# Altium schematic sheet Pico.SchDoc
size A4
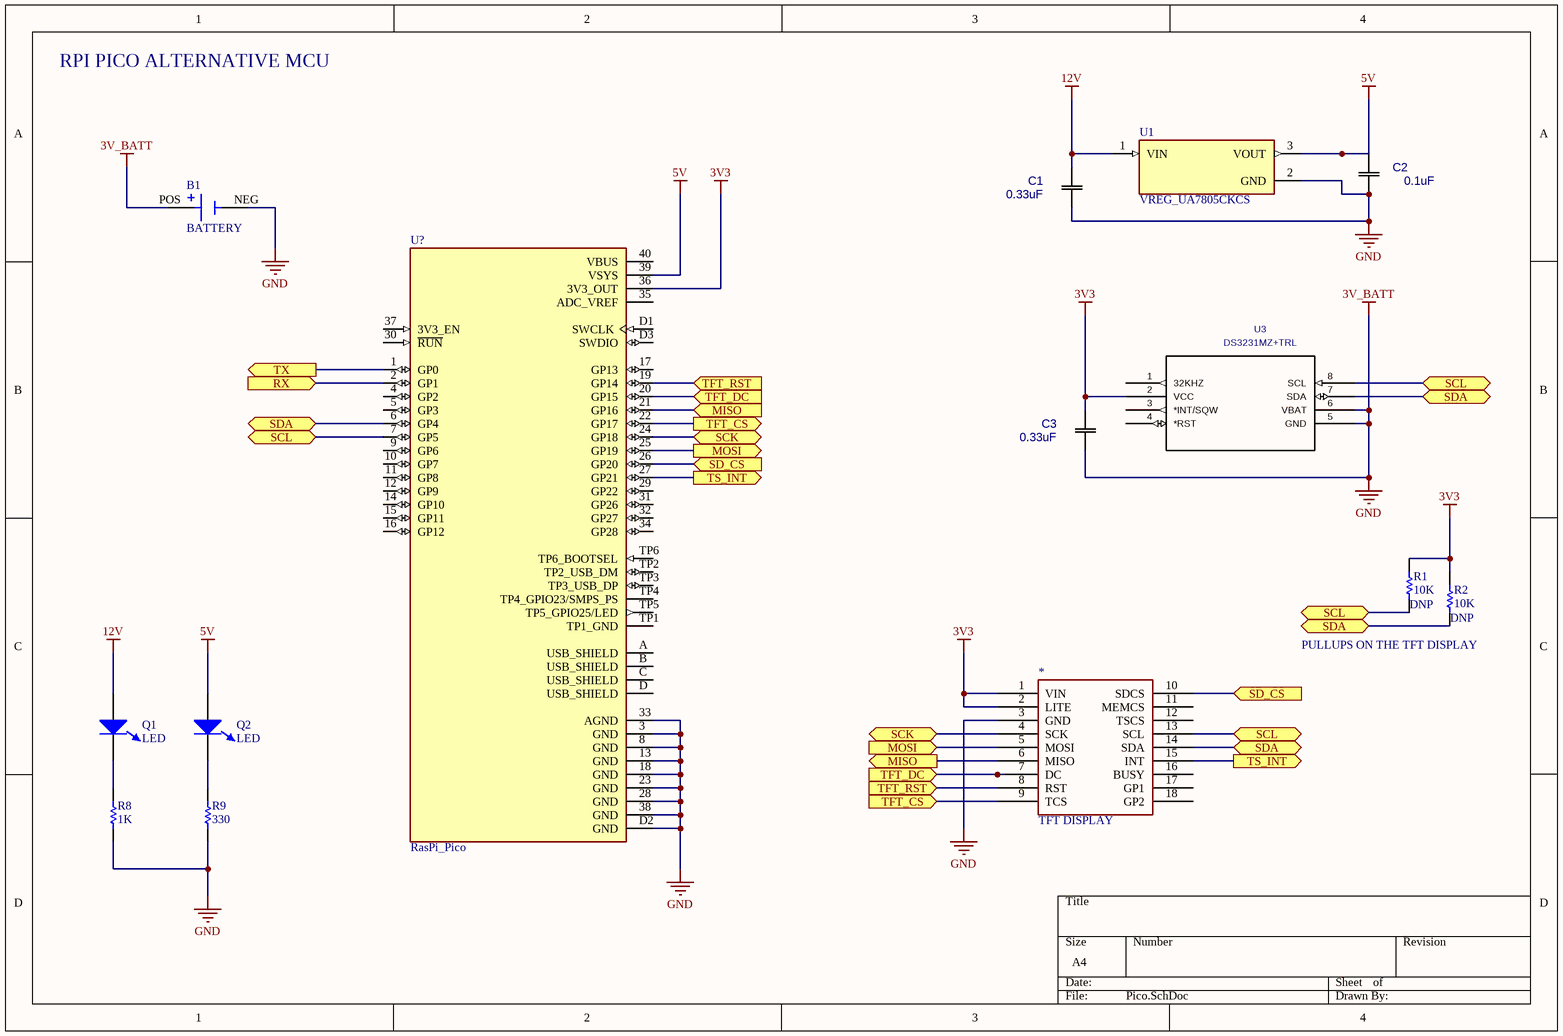
[diagram p0: Pico.SchDoc]

## Parts
*  TFT DISPLAY
B1  BATTERY
C1  value 0.33uF  [CAP_TH_CER_5MM]  (hidden comment: CAP_TH_CER)
C2  value 0.1uF  [CAP_TH_CER_5MM]  (hidden comment: CAP_TH_CER)
C3  value 0.33uF  [CAP_TH_CER_5MM]  (hidden comment: CAP_TH_CER)
Q1  LED  [DIODE_0603]
Q2  LED  [DIODE_0603]
R1  10K  NOTE: DNP
R2  10K  NOTE: DNP
R8  1K
R9  330
U1  VREG_UA7805CKCS  [TO-220-3_7805]
U3  DS3231MZ+TRL  [8-SOIC-3.90MM]
U?  RasPi_Pico  [RasPi_Pico]

## Ports
MISO, MOSI, RX, SCK, SCL, SD_CS, SDA, TFT_CS, TFT_DC, TFT_RST, TS_INT, TX

## Nets
3V3: *.1(VIN) *.2(LITE) C3.2 R1.2 R2.2 U3.2(VCC) U?.36(3V3_OUT)
3V_BATT: *.3(GND) B1.NEG B1.POS C1.1 C2.1 C3.1 R8.1 R9.1 U1.2(GND) U3.5(GND) U3.6(VBAT) U?.3(GND) U?.8(GND) U?.13(GND) U?.18(GND) U?.23(GND) U?.28(GND) U?.33(AGND) U?.38(GND) U?.D2(GND)  [also labelled GND]
5V: C2.2 Q2.1(A) U1.3(VOUT) U?.39(VSYS)
12V: C1.2 Q1.1(A) U1.1(VIN)
MISO: *.6(MISO) U?.21(GP16) ; port MISO
MOSI: *.5(MOSI) U?.25(GP19) ; port MOSI
RX: U?.2(GP1) ; port RX
SCK: *.4(SCK) U?.24(GP18) ; port SCK
SCL: *.13(SCL) R1.1 U3.8(SCL) U?.7(GP5) ; port SCL
SD_CS: *.10(SDCS) U?.26(GP20) ; port SD_CS
SDA: *.14(SDA) R2.1 U3.7(SDA) U?.6(GP4) ; port SDA
TFT_CS: *.9(TCS) U?.22(GP17) ; port TFT_CS
TFT_DC: *.7(DC) U?.20(GP15) ; port TFT_DC
TFT_RST: *.8(RST) U?.19(GP14) ; port TFT_RST
TS_INT: *.15(INT) U?.27(GP21) ; port TS_INT
TX: U?.1(GP0) ; port TX
NetQ1_2: Q1.2(K) R8.2
NetQ2_2: Q2.2(K) R9.2

Not connected (* = marked no-connect by the designer): * 11(MEMCS) 12(TSCS) 16(BUSY) 17(GP1) 18(GP2); U3 1(32KHZ) 3(*INT/SQW) 4(*RST); U? 4(GP2) 5(GP3) 9(GP6) 10(GP7) 11(GP8) 12(GP9) 14(GP10) 15(GP11) 16(GP12) 17(GP13) 29(GP22) 30(~{RUN}) 31(GP26) 32(GP27) 34(GP28) 35(ADC_VREF) 37(3V3_EN) 40(VBUS) A(USB_SHIELD) B(USB_SHIELD) C(USB_SHIELD) D(USB_SHIELD) D1(SWCLK) D3(SWDIO) TP1(TP1_GND) TP2(TP2_USB_DM) TP3(TP3_USB_DP) TP4(TP4_GPIO23/SMPS_PS) TP5(TP5_GPIO25/LED) TP6(TP6_BOOTSEL)

## Notes on the sheet
- RPI PICO ALTERNATIVE MCU
- PULLUPS ON THE TFT DISPLAY

## Library data of the parts
* = EYESPI_TFT_BREAKOUT
B1 = BATTERY: MPN: 1060TR
C1-C3 = CAP_TH_CER: Mfr_Name: TDK
Q1 Q2 = DIODE_LED
R1 R2 R8 R9 = RES: Resistor; Value: ? Ohms; MPN: ?; SuppliersPartNumber: ?; Power: ?
U1 = VREG_UA7805CKCS: 1.5-A, 38-V, linear voltage regulator; Price: None; MP: UA7805CKCS; Value: *; Availability: Unavailable; Package: None
U3 = IC_RTC_DS3231MZ+TRL: Mfr_Name: Analog Devices Inc; Value: DS3231MZ+TRL; Manufacturer_Part_Number: DS3231MZ+TRL
U? = RasPi_Pico: RP2040 Raspberry Pi Pico series ARMÂ® CortexÂ®-M0+ MCU 32-Bit Embedded Evaluation Board; MP: SC0915; MF: Raspberry Pi